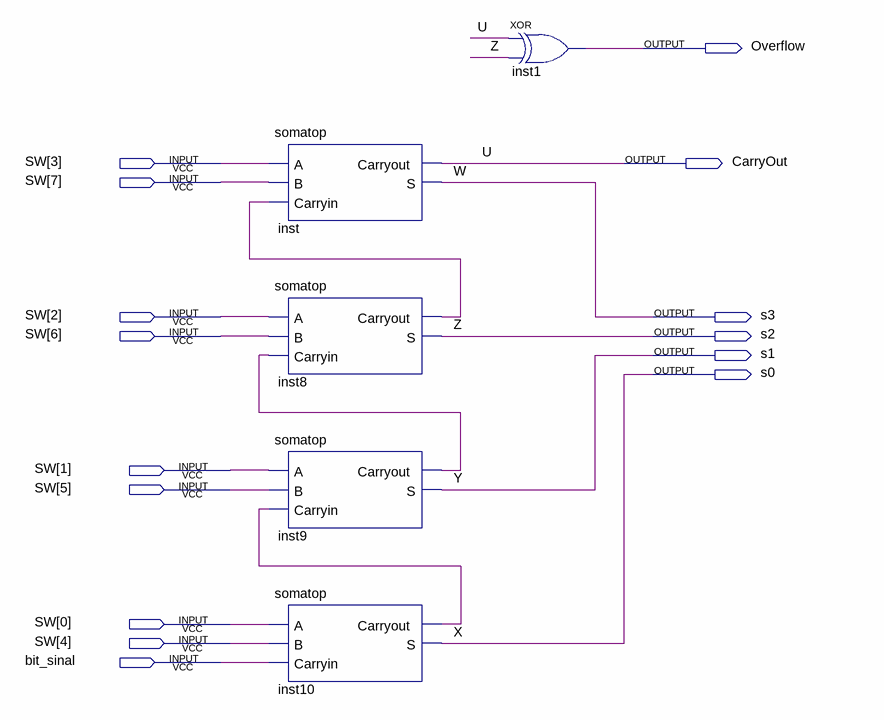
[diagram p0: schematic sheet]
// Quartus schematic Cont.bdf as structural Verilog: 5 symbols, 15 pins
module Cont (
  input  [7:0] SW,
  input  bit_sinal,
  output Overflow,
  output CarryOut,
  output s3,
  output s2,
  output s1,
  output s0
);

  wire inst8_carryout, inst9_carryout, inst10_carryout;

  somatop inst (.A(SW[3]), .B(SW[7]), .Carryin(inst8_carryout), .Carryout(CarryOut), .S(s3));
  somatop inst8 (.A(SW[2]), .B(SW[6]), .Carryin(inst9_carryout), .Carryout(inst8_carryout), .S(s2));
  somatop inst9 (.A(SW[1]), .B(SW[5]), .Carryin(inst10_carryout), .Carryout(inst9_carryout), .S(s1));
  somatop inst10 (.A(SW[0]), .B(SW[4]), .Carryin(bit_sinal), .Carryout(inst10_carryout), .S(s0));
  xor inst1 (Overflow, CarryOut, s2);

  // Other names for the same wires on the sheet: X = s0; Y = s1; W = s3; U = CarryOut; Z = s2
endmodule
